# Altium schematic sheet Thermometers.SchDoc
size A4; DocumentNumber: 12; SheetNumber: 12; SheetTotal: 30
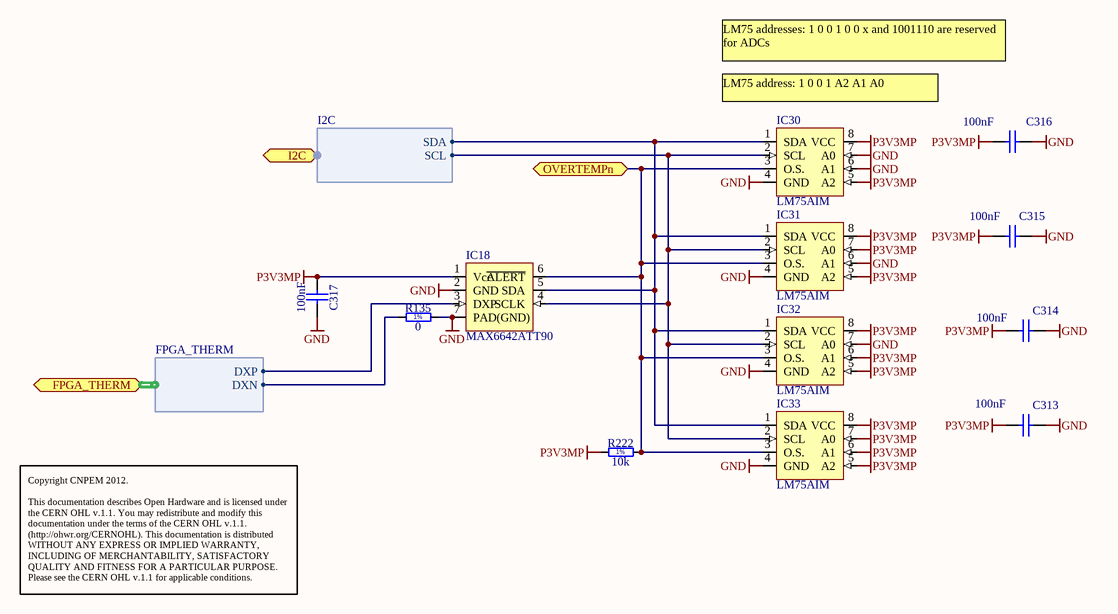
[diagram p0: Thermometers.SchDoc]

## Parts
C313  100nF  [CAPC0603X33N]
C314  100nF  [CAPC0603X33N]
C315  100nF  [CAPC0603X33N]
C316  100nF  [CAPC0603X33N]
C317  100nF  [CAPC0603X33N]
IC18  MAX6642ATT90  [TFDN6]
IC30  LM75AIM  [SOIC127P600X175-8N]
IC31  LM75AIM  [SOIC127P600X175-8N]
IC32  LM75AIM  [SOIC127P600X175-8N]
IC33  LM75AIM  [SOIC127P600X175-8N]
R135  0  [RESC1005X40N]
R222  10k  [RESC1005X40N]

## Ports
FPGA_THERM (harness FPGA_THERM), I2C (harness I2C), OVERTEMPn (bidir)

## Harnesses
FPGA_THERM: DXN, DXP
I2C: SCL, SDA

## Nets
GND: C313.2 C314.2 C315.2 C316.2 C317.2 IC18.2(GND) IC18.7(PAD(GND)) IC30.4(GND) IC30.6(A1) IC30.7(A0) IC31.4(GND) IC31.6(A1) IC32.4(GND) IC32.7(A0) IC33.4(GND) R135.2
P3V3MP: C313.1 C314.1 C315.1 C316.1 C317.1 IC18.1(Vcc) IC30.5(A2) IC30.8(VCC) IC31.5(A2) IC31.7(A0) IC31.8(VCC) IC32.5(A2) IC32.6(A1) IC32.8(VCC) IC33.5(A2) IC33.6(A1) IC33.7(A0) IC33.8(VCC) R222.1
OVERTEMPn: IC18.6(~{ALERT}) IC30.3(O.S.) IC31.3(O.S.) IC32.3(O.S.) IC33.3(O.S.) R222.2 ; port OVERTEMPn
NetIC18_3: IC18.3(DXP) ; port FPGA_THERM.DXP
NetIC18_4: IC18.4(SCLK) IC30.2(SCL) IC31.2(SCL) IC32.2(SCL) IC33.2(SCL) ; port I2C.SCL
NetIC18_5: IC18.5(SDA) IC30.1(SDA) IC31.1(SDA) IC32.1(SDA) IC33.1(SDA) ; port I2C.SDA
NetR135_1: R135.1 ; port FPGA_THERM.DXN

## Notes on the sheet
- (near IC30) LM75 address: 1 0 0 1 A2 A1 A0
- LM75 addresses: 1 0 0 1 0 0 x and 1001110 are reserved for ADCs
- Copyright CNPEM 2012.
  This documentation describes Open Hardware and is licensed under the CERN OHL v.1.1. You may redistribute and modify this documentation under the terms of the CERN OHL v.1.1. (http://ohwr.org/CERNOHL). This documentation is distributed WITHOUT ANY EXPRESS OR IMPLIED WARRANTY, INCLUDING OF MERCHANTABILITY, SATISFACTORY QUALITY AND FITNESS FOR A PARTICULAR PURPOSE. Please see the CERN OHL v.1.1 for applicable conditions.
- (in symbol R0402_0R_JUMPER) 1%
- (in symbol R0402_10K_1%_0.0625W_100PPM) 1%

## Library data of the parts
C313-C317 = CC0201_100NF_6.3V_10%_X5R: Non-polarised capacitor; Part Description: SMD Multilayer Chip Ceramic Capacitor; Manufacturer: GENERIC; Manufacturer1 Part Number: 02016D104KAT2A; Voltage: 6.3V; TC: X5R; Tolerance: ±10%; Table: Capacitors SMD; Part Number: CC0201_100NF_6.3V_10%_X5R; Component Kind: Standard; Component Type: Standard; Pin Count: 2; Value: 100nF; Status: Not Recommended; Manufacturer Part Number: CC0201_100NF_6.3V_10%_X5R; Case: 0201; Mounted: Yes; Socket: No; SMD: Yes; Manufacturer1 Example: AVX; Manufacturer1 ComponentHeight: 0.33mm; HelpURL: \\cern.ch\dfs\Applications\Altium\Datasheets\CC0201_X5R_AVX.pdf; Author: CERN DEM JLC; CreateDate: 2007-12-03; LatestRevisionDate: 2007-12-03
IC18 = SENS_MAX6642: ±1°C, SMBus- Remote/Local Temperature Sensor with Overtemperature Alarm; Supplier 1: Digi-Key; Supplier Part Number 1: MAX6642ATT90+TCT-ND
IC30-IC33 = SENS_LM75: I2C temperature sensor
R135 = R0402_0R_JUMPER: Resistor - 1%; Part Description: 1A (0.05R Max DC Resistance) Zero Ohm Jumper; Manufacturer: GENERIC; Manufacturer1 Part Number: 232270591001L; Table: Resistors SMD; Part Number: R0402_0R_JUMPER; Component Kind: Standard; Component Type: Standard; Pin Count: 2; Value: 0; Status: Not recommended; Manufacturer Part Number: R0402_0R_JUMPER; Case: 0402; Mounted: Yes; Socket: No; SMD: Yes; Manufacturer1 Example: YAGEO PHYCOMP; Manufacturer1 ComponentHeight: 0.4mm; HelpURL: \\cern.ch\dfs\Applications\Altium\Datasheets\R0402_Phycomp_RC0402.pdf; Author: CERN DEM JLC; CreateDate: 2007-12-03; LatestRevisionDate: 2012-10-17
R222 = R0402_10K_1%_0.0625W_100PPM: Resistor - 1%; Part Description: General Purpose Thick Film Chip Resistor; Manufacturer: GENERIC; Manufacturer1 Part Number: 232270671003L; TC: ±100ppm/°C; Table: Resistors SMD; Part Number: R0402_10K_1%_0.0625W_100PPM; Component Kind: Standard; Component Type: Standard; Pin Count: 2; Value: 10k; Status: Not recommended; Power: 0.0625W; Tolerance: ±1%; Manufacturer Part Number: R0402_10K_1%_0.0625W_100PPM; Case: 0402; Mounted: Yes; Socket: No; SMD: Yes; Manufacturer1 Example: YAGEO PHYCOMP; Manufacturer1 ComponentHeight: 0.4mm; HelpURL: \\cern.ch\dfs\Applications\Altium\Datasheets\R0402_Phycomp_RC0402.pdf; Author: CERN DEM JLC; CreateDate: 2007-12-03; LatestRevisionDate: 2012-10-17